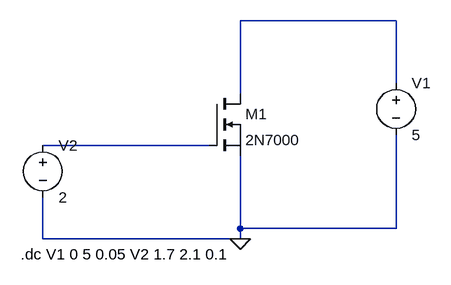
[diagram p0: schematic scheme2.asc]
scheme2.asc, the LTspice schematic file:
Version 4
SHEET 1 880 680
WIRE 368 16 128 16
WIRE 368 112 368 16
WIRE 128 128 128 16
WIRE 80 208 -176 208
WIRE 128 336 128 224
WIRE 368 336 368 192
WIRE 368 336 128 336
WIRE -176 352 -176 288
WIRE 128 352 128 336
WIRE 128 352 -176 352
FLAG 128 352 0
SYMBOL voltage 368 96 R0
WINDOW 123 0 0 Left 2
WINDOW 39 0 0 Left 2
SYMATTR InstName V1
SYMATTR Value 5
SYMBOL voltage -176 192 R0
WINDOW 123 0 0 Left 2
WINDOW 39 0 0 Left 2
SYMATTR InstName V2
SYMATTR Value 2
SYMBOL nmos 80 128 R0
SYMATTR InstName M1
SYMATTR Value 2N7000
TEXT -210 376 Left 2 !.dc V1 0 5 0.05 V2 1.7 2.1 0.1

The netlist it stands for:
* scheme2.asc
V1 N001 0 5
V2 N002 0 2
M1 N001 N002 0 0 2N7000
.model NMOS NMOS
.model PMOS PMOS
.lib standard.mos
.dc V1 0 5 0.05 V2 1.7 2.1 0.1
.backanno
.end